# Altium schematic sheet P_IN.SchDoc
size B; SheetNumber: 1; SheetTotal: 2
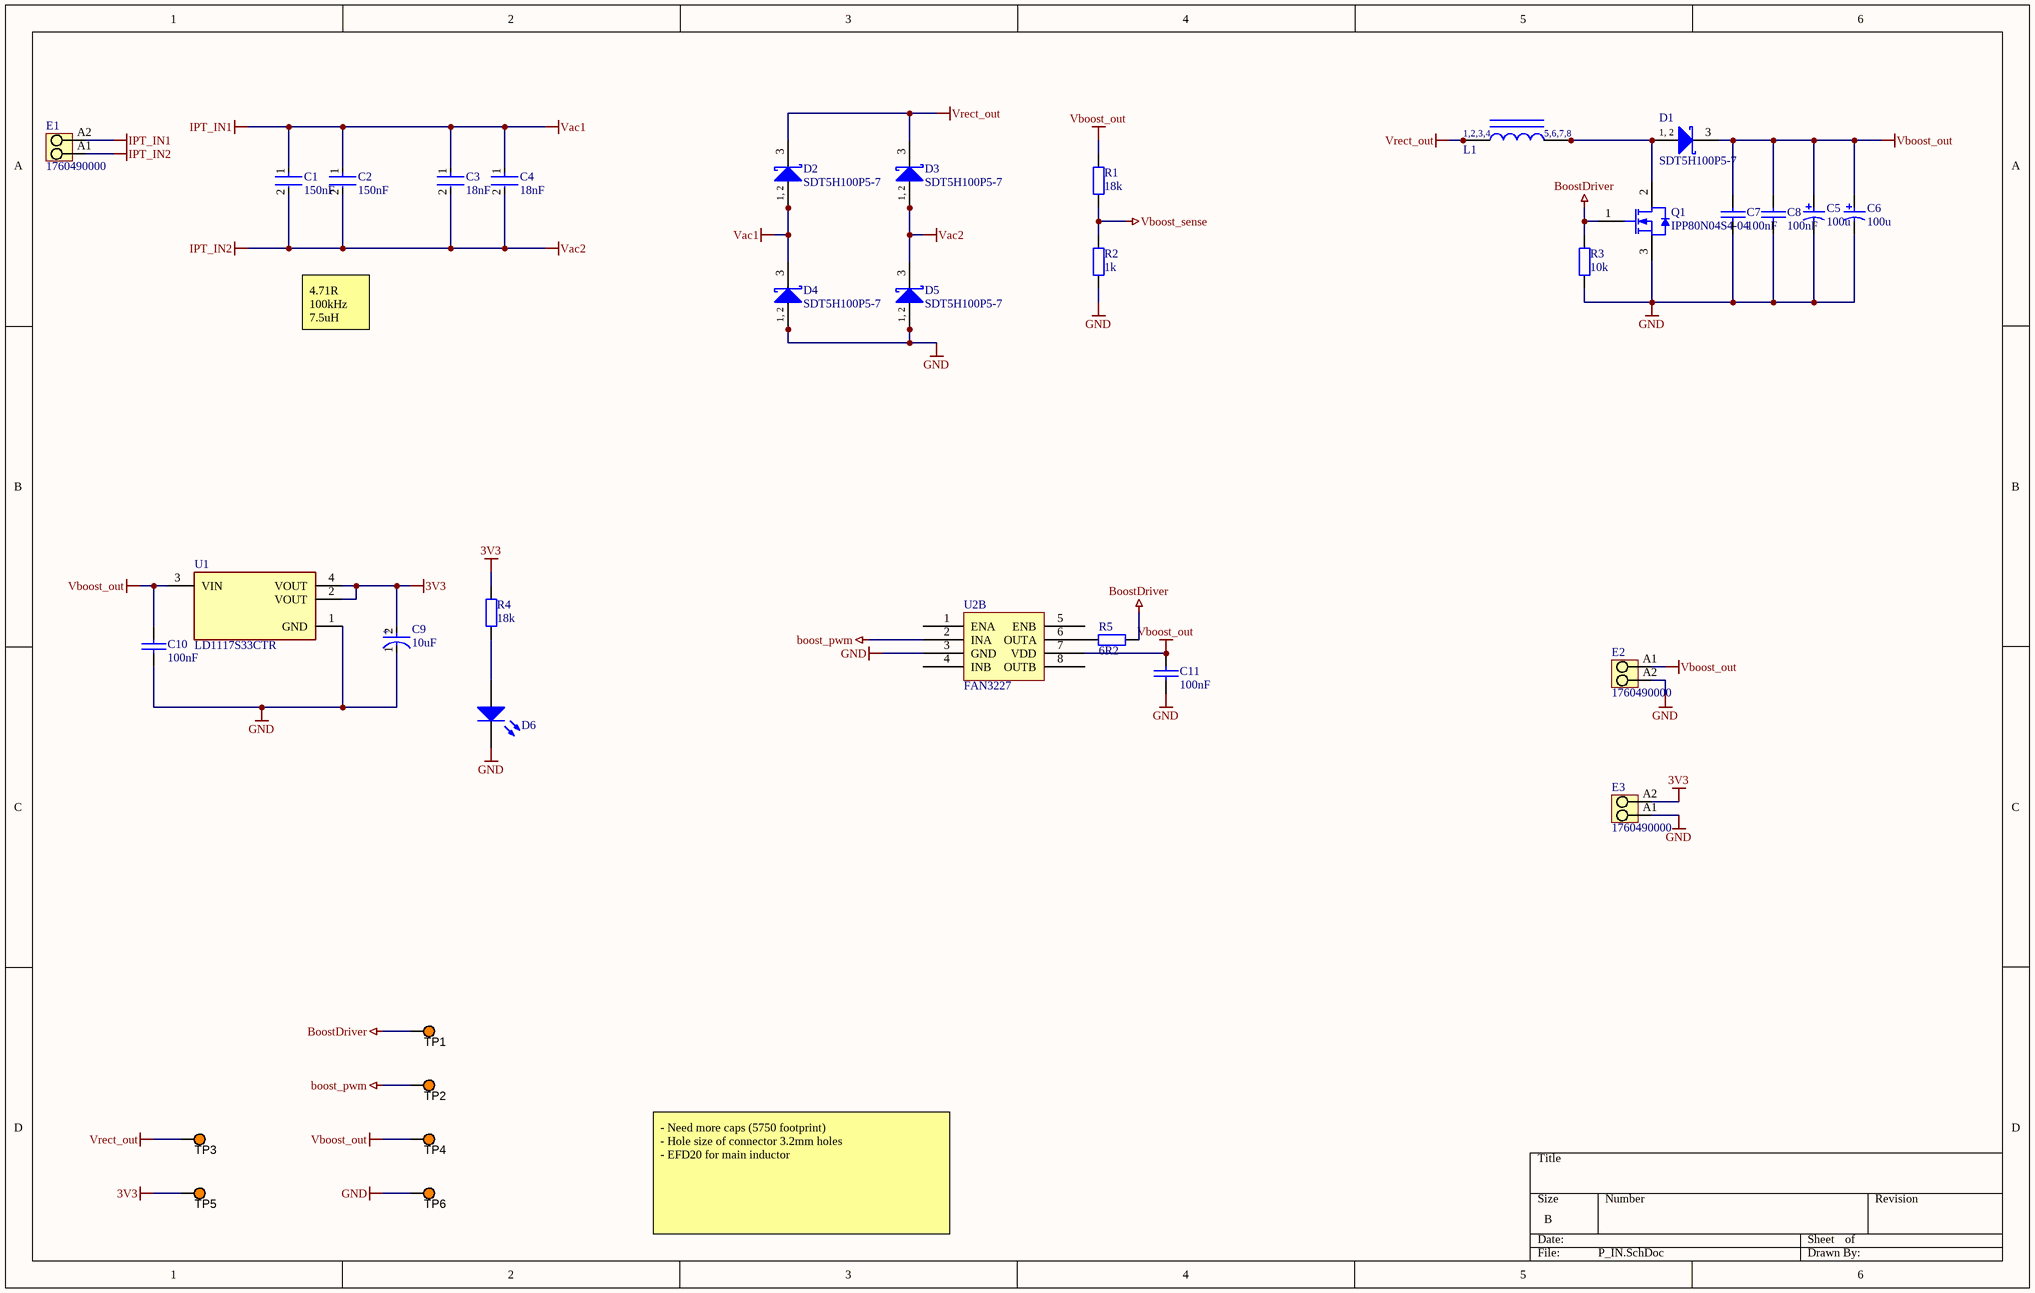
[diagram p0: P_IN.SchDoc]

## Parts
C1  150nF  [FP-C5750-230-0_4-MFG]
C2  150nF  [FP-C5750-230-0_4-MFG]
C3  18nF  [FP-C5750-230-0_4-MFG]
C4  18nF  [FP-C5750-230-0_4-MFG]
C5  100u  [CAPAE7067X55L]
C6  100u  [CAPAE7067X55L]
C7  100nF  [0805 CAP]
C8  100nF  [0805 CAP]
C9  10uF  [FP-SB-MFG]
C10  100nF  [0805 CAP]
C11  100nF  [0805 CAP]
D1  SDT5H100P5-7  [DIOD-POWERDI5-3_V]
D2  SDT5H100P5-7  [DIOD-POWERDI5-3_V]
D3  SDT5H100P5-7  [DIOD-POWERDI5-3_V]
D4  SDT5H100P5-7  [DIOD-POWERDI5-3_V]
D5  SDT5H100P5-7  [DIOD-POWERDI5-3_V]
D6  LTST-C170KGKT  [0805 LED]  (value not drawn)
E1  1760490000  [PM_5_08_90_02]
E2  1760490000  [PM_5_08_90_02]
E3  1760490000  [PM_5_08_90_02]
L1  Inductor  [EFD20]  (value not drawn)
Q1  IPP80N04S4-04  [INF-PG-TO220-3-1]
R1  18k  [0805 RES]
R2  1k  [0805 RES]
R3  10k  [0805 RES]
R4  18k  [0805 RES]
R5  6R2  [0805 RES]
TP1  5003  [TP_TH]  (value not drawn)
TP2  5003  [TP_TH]  (value not drawn)
TP3  5003  [TP_TH]  (value not drawn)
TP4  5003  [TP_TH]  (value not drawn)
TP5  5003  [TP_TH]  (value not drawn)
TP6  5003  [TP_TH]  (value not drawn)
U1  LD1117S33CTR  [FP-SOT-223-0046067_14-MFG]
U2  FAN3227  [SOIC-8]  (part B of 2)

## Nets
3V3: C9.2(A) E3.A2 R4.2 TP5.1 U1.2(VOUT) U1.4(VOUT)
boost_pwm: TP2.1 U2.2(INA)
BoostDriver: Q1.1(GATE) R3.2 R5.2 TP1.1
GND: C5.2 C6.2 C7.2 C8.2 C9.1(C) C10.2 C11.2 D4.1(A) D4.2(A) D5.1(A) D5.2(A) D6.2(K) E2.A2 E3.A1 Q1.3(SOURCE) R2.1 R3.1 TP6.1 U1.1(GND) U2.3(GND)
IPT_IN1: C1.1 C2.1 C3.1 C4.1 D2.1(A) D2.2(A) D4.3(K) E1.A2  [also labelled Vac1]
IPT_IN2: C1.2 C2.2 C3.2 C4.2 D3.1(A) D3.2(A) D5.3(K) E1.A1  [also labelled Vac2]
Vboost_out: C5.1 C6.1 C7.1 C8.1 C10.1 C11.1 D1.3(K) E2.A1 R1.2 TP4.1 U1.3(VIN) U2.7(VDD)
Vboost_sense: R1.1 R2.2
Vrect_out: D2.3(K) D3.3(K) L1.1 L1.2 L1.3 L1.4 TP3.1
NetD1_1: D1.1(A) D1.2(A) L1.5 L1.6 L1.7 L1.8 Q1.2(DRAIN)
NetD6_1: D6.1(A) R4.1
NetR5_1: R5.1 U2.6(OUTA)

Not connected (* = marked no-connect by the designer): U2 1(ENA) 4(INB) 5(ENB) 8(OUTB)

## Notes on the sheet
- 4.71R
  100kHz
  7.5uH
- - Need more caps (5750 footprint)
  - Hole size of connector 3.2mm holes
  - EFD20 for main inductor
- (in symbol CMP-2000-07476-1) 1, 2
- (in symbol CMP-05427-000070-1) +
- (in symbol Inductor EFD20) 1,2,3,4; 5,6,7,8

## Library data of the parts
C1-C4 = CMP-08246-002717-1: Multilayer Ceramic Capacitors 10uF ±10% 50V X5R SMD 2220; Width: 0.197inch; Tolerance: 10%; Capacitance: 10uF; Voltage: 50V; Length: 5.7mm; Thickness: 0.098inch; Termination: SMD/SMT; Packaging: Tape and Reel; REACH SVHC: No SVHC; Depth: 5mm; Package Quantity: 1; Lead Free: Lead Free; Voltage Rating (DC): 50V; Case Code (Imperial): 2220; Height: 2.3mm; Case/Package: 2220; Dielectric: X5R; Case Code (Metric): 5750; Number of Pins: 2; Min Operating Temperature: -55°C; Weight: 0.016932oz; Voltage Rating: 50V; Series: C; Construction: Flat; Resistor Type: Ceramic; Max Operating Temperature: 85°C; Dielectric Material: Ceramic; RoHS Compliant: Yes; Radiation Hardening: No; Mount: Surface Mount
C5 C6 = CMP-2000-07374-1: Aluminum Electrolytic Capacitor, 100 uF, +/- 20%, 16 V, -40 to 85 degC, 2-Pin SMD, RoHS, Tape and Reel; Manufacturer: Nichicon; Type: Can; Rated Voltage: 16V; Capacitance: 100µF; Case Size/Dimension: Ø6.3x5.4mm; Mounting Technology: SurfaceMount; Datasheet Version: 08/2015; Operating Temp-Max: 85°C; Datasheet URL: http://nichicon-us.com/english/products/pdfs/e-uwx.pdf; Package Description: 2-Pin Surface Mount Device, Body 6.6 x 6.6 mm; Package Reference: CAPAE7067X55; Manufacturer URL: http://www.nichicon.co.jp/english/
C7 C8 C10 C11 = CerCap_SMT_0805: SMT ceramic capacitor 0805 size; Value: *
C9 = CMP-05427-000070-1: CAP ALUM 1UF 20% 50V SMD; Polarity: Polar; Dielectric Material: Aluminium; Ripple Current (AC): 10mA; Leakage Current: 3uA; Life (Hours): 2000Hour; Lead Length: 1.8mm; Voltage Rating: 50V; Width: 4.3mm; Capacitance: 1uF; Min Operating Temperature: -40°C; Height: 5.4mm; Height - Seated (Max): 0.213inch; Mount: Surface Mount; RoHS Compliant: Yes; Case/Package: Radial; Packaging: Tape and Reel; Ripple Current: 10mA; Construction: Cylindrical; Contact Plating: Tin; Max Operating Temperature: 85°C; Termination: SMD/SMT; Lead Pitch: 1mm; Package Quantity: 2000; Tolerance: 20%; Number of Pins: 2; Lead Free: Lead Free; Length: 5.5mm; Voltage: 50V; Series: S; Diameter: 4mm; Radiation Hardening: No; Voltage Rating (DC): 50V; REACH SVHC: No SVHC
D1-D5 = CMP-2000-07476-1: Schottky Barrier Rectifier, 60 V, 7 A, -65 to 150 degC, 3-Pin SMD, RoHS, Tape and Reel; Manufacturer: Diodes Inc; Max Repetitive Reverse Voltage (Vrrm): 60V; Element Configuration: CommonAnode; Max Forward Surge Current (Ifsm): 275A; Polarity: Standard; Forward Voltage: 620mV; Forward Current: 7A; Peak Reverse Current: 200uA; Case\/Package: SMD/SMT; Manufacturer URL: http://www.diodes.com/; Reverse Voltage (DC): 60V; Lead Free: LeadFree; Voltage Rating (DC): 60V; Min Operating Temperature: -65degC; Package Description: 3-Pin Surface Mount Device, Body 3.975 x 5.375 mm, Pitch 1.84 mm; Length: 4.05mm; Datasheet URL: https://www.diodes.com/assets/Datasheets/ds30477.pdf; REACH SVHC: NoSVHC; Peak Non-Repetitive Surge Current: 275A; Output Current: 7A; Contact Plating: Matte; Mounting Technology: SurfaceMount; Mount: SurfaceMount; RoHSCompliant: true; Weight: 0.003386oz; Current Rating: 7A; Max Operating Temperature: 150degC; Package Quantity: 5000; Height: 1.15mm; Average Rectified Current: 7A; Datasheet Version: Rev. 13-2, 10/2012; Number of Pins: 5; Width: 5.45mm; Packaging: TapeandReel; Radiation Hardening: No; Package Reference: POWERDI5-3
D6 = LED_SMT_0805: SMT LED 0805 size; Manufacturer: Lite-On Inc.; Color: Green; Lens Color: Colorless; Lens Transparency: Clear; Millicandela Rating: 35mcd; Lens Style/Size: Rectangle with Flat Top, 1.40mm x 1.25mm; Voltage - Forward (Vf) (Typ): 2V; Current - Test: 20mA; Viewing Angle: 130°; Wavelength - Dominant: 571nm; Wavelength - Peak: 574nm; Supplier 1: Digi-Key; Manufacturer Part Number: LTST-C170KGKT; RoHS: RoHS Compliant; Category: Optoelectronics; Stock 1: 503069; Pricing 1: 1=0.62, 10=0.459, 25=0.338, 100=0.2415, 250=0.16416, 500=0.14486, 1000=0.11347 (NZD); Packaging: Cut Tape (CT); Part Status: Active; Mounting Type: Surface Mount; Features: -; Package / Case: 0805 (2012 Metric); Size / Dimension: 2.00mm L x 1.25mm W; Height (Max): 1.10mm; ComponentLink1URL: http://optoelectronics.liteon.com/upload/download/DS22-2000-073/LTST-C170KGKT.pdf; ComponentLink1Description: http://optoelectronics.liteon.com/upload/download/DS22-2000-073/LTST-C170KGKT.pdf; Supplier Part Number 1: 160-1414-1-ND
E1-E3 = CMP-1559-01627-1: OMNIMATE Signal - series PM; Manufacturer: Weidmueller; Contact_surface: tinned; Pitch_mm: 5,08 mm; Solid_min_H05_07_V_U: 0,13 mm²; Wire_cross_section_AWG_min_UL_1059: AWG 26; Wire_cross_section_AWG_max_UL_1059: AWG 14; Rated_voltage_for_surge_voltage_class_pollution_degree_II_2: 600 V; Rated_current_use_group_B_UL_1059: 15 A; Mounting_onto_the_PCB: Solder connection; Solder_pin_length_mm: 3,5 mm; Side_termination_characteristic: closed side; Contact_material: Cu-Leg; Pitch_inch: 0,2 inch; No_of_poles: 2; UL_94_flammability_rating: V-0; Insulating_material: Wemid (PA); Rated_voltage_use_group_B_UL_1059: 300 V; Solid_max_H05_07_V_U: 2,5 mm²; Short_text_for_material: PM 5.08/02/90 3.5SN OR BX; Revision: V1; PartNumber: 1760490000; Qty: 500 PCS; ComponentLink2Description: URL Link1; Packaging: Box; PackageReference: PM_5_08_90_02; ComponentLink2URL: http://catalog.weidmueller.com/catalog/Start.do?localeId=en&ObjectID=1760490000; Colour: Orange; ComponentLink1Description: Manufacturer URL; ComponentLink1URL: http://www.weidmueller.com/
L1 = Inductor EFD20: Inductor with core
Q1 = CMP-1138-00045-1: OptiMOS-T2 Power-Transistor, 40 V VDS, 80 A ID, PG-TO220-3-1, Tube, Green; Manufacturer: Infineon; VDS (max): 40 V; RDS (on) (max) (@10V): 4.6 mOhm; Ptot (max): 71 W; IDpuls (max): 320 A; Green: TRUE; VGS(th) (max): 4 V; QG: 33 nC; RthJC (max): 2.1 K/W; ID (max): 80 A; VGS(th) (min): 2 V; PartNumber: IPP80N04S4-04; ComponentLink2Description: Datasheet; DatasheetVersion: Rev. 1.0; Halogen-free: TRUE; ComponentLink3Description: Package Specification; PackageDescription: 3-Pin Plastic (Green) Transistor Single Outline Package, 10 x 9.25 mm Body, 2.54 mm Pitch; ComponentLink3URL: http://www.infineon.com/dgdl/BTS117_DS_14.pdf?folderId=db3a30431400ef68011421b54e2e0564&fileId=db3a30433a747525013abff8302d549c&location=en.Products.Automotive_ICs.Smart_High-_and_Low-Side_Switches.HITFET___TEMPFET__-_Smart_Low-Side_Switches.DATASHEET.BTS1; PackageReference: PG-TO220-3-1; PackageVersion: Jul-12; Packing: Tube; ComponentLink1Description: Manufacturer URL; ComponentLink2URL: http://www.infineon.com/dgdl/IPP_B_I80N04S4-04_DS_1_0.pdf?folderId=db3a304412b407950112b42b75b74520&fileId=db3a304328c6bd5c01291c71d4085dfa&location=en.Products.Automotive_ICs.Automotive_MOSFETs.Single__N-Channel_40V_MOSFETs.DATASHEET.IPP_B_I80N04S4-04_DS_; Mounting Technology: Through Hole; ComponentLink1URL: http://www.infineon.com/; Technology: OptiMOS-T2
R1-R5 = Res_SMT_0805: 0805 resistor; Published: 8-Jun-2000; LatestRevisionDate: 17-Jul-2002; LatestRevisionNote: Re-released for DXP Platform.; PackageReference: AXIAL-0.4; Publisher: Altium Limited; Value: *; ComponentLink1Description: https://nz.mouser.com/datasheet/2/315/AOA0000C304-1149620.pdf
TP1-TP6 = TestPoint: Test Point, Orange, 1-Pin THD, RoHS; Peak Reverse Current: 600 uA; Forward Current: 3 A; Max Surge Current: 80 A; Forward Voltage: 1.08 V; Max Operating Temperature: 150 degC; PackageReference: 5003; Pins: 2; ComponentLink2URL: http://keyelco.com/userAssets/file/M65p56.pdf; PackageDescription: 1-Pin Through Hole Device, Dia 2.54 mm; Weight: 0.01 lb; Diameter: 5.3 mm; Mount: Through Hole; Package Quantity: 500; Packaging: Bulk; Min Operating Temperature: -65 degC; ComponentLink1Description: Manufacturer URL; Height: 0.25 inch; ComponentLink1URL: http://www.keyelco.com/; ComponentLink2Description: Datasheet; Width: 0.25 inch; REACH SVHC: No SVHC; RoHSCompliant: true; Radiation Hardening: No; Length: 9.5 mm; DatasheetVersion: Jun-15
U1 = CMP-0244-00307-2: IC REG LINEAR 3.3V 800MA SOT223; Input Bias Current: 5mA; Output Voltage Accuracy: 1%; Dropout Voltage: 1.1V; Power Dissipation: 12W; Polarity: Positive; Min Input Voltage: 5.3V; Quiescent Current: 10mA; Max Output Current: 1.3A; Output Current: 950mA; Number of Regulators: 1; Max Supply Voltage: 15V; Output Type: Fixed; Output Voltage: 3.3V; Number of Terminals: 4; Min Supply Voltage: 3.3V; Termination: SMD/SMT; Mount: Surface Mount; Max Power Dissipation: 12W; Case/Package: SOT-223; Lead Free: Lead Free; Height: 1.8mm; REACH SVHC: No SVHC; Radiation Hardening: No; Width: 3.5mm; Length: 6.5mm; Packaging: Tape and Reel; Max Input Voltage: 15V; Accuracy: 1%; Weight: 0.01lb; Contact Plating: Tin; Max Operating Temperature: 125°C; Number of Pins: 4; Max Output Voltage: 3.3V; Min Operating Temperature: -40°C; Nominal Output Voltage: 3.3V; Package Quantity: 1; Min Output Voltage: 3.3V; Number of Outputs: 1